# EAGLE design CR78-TB (EAGLE 7.6.0)
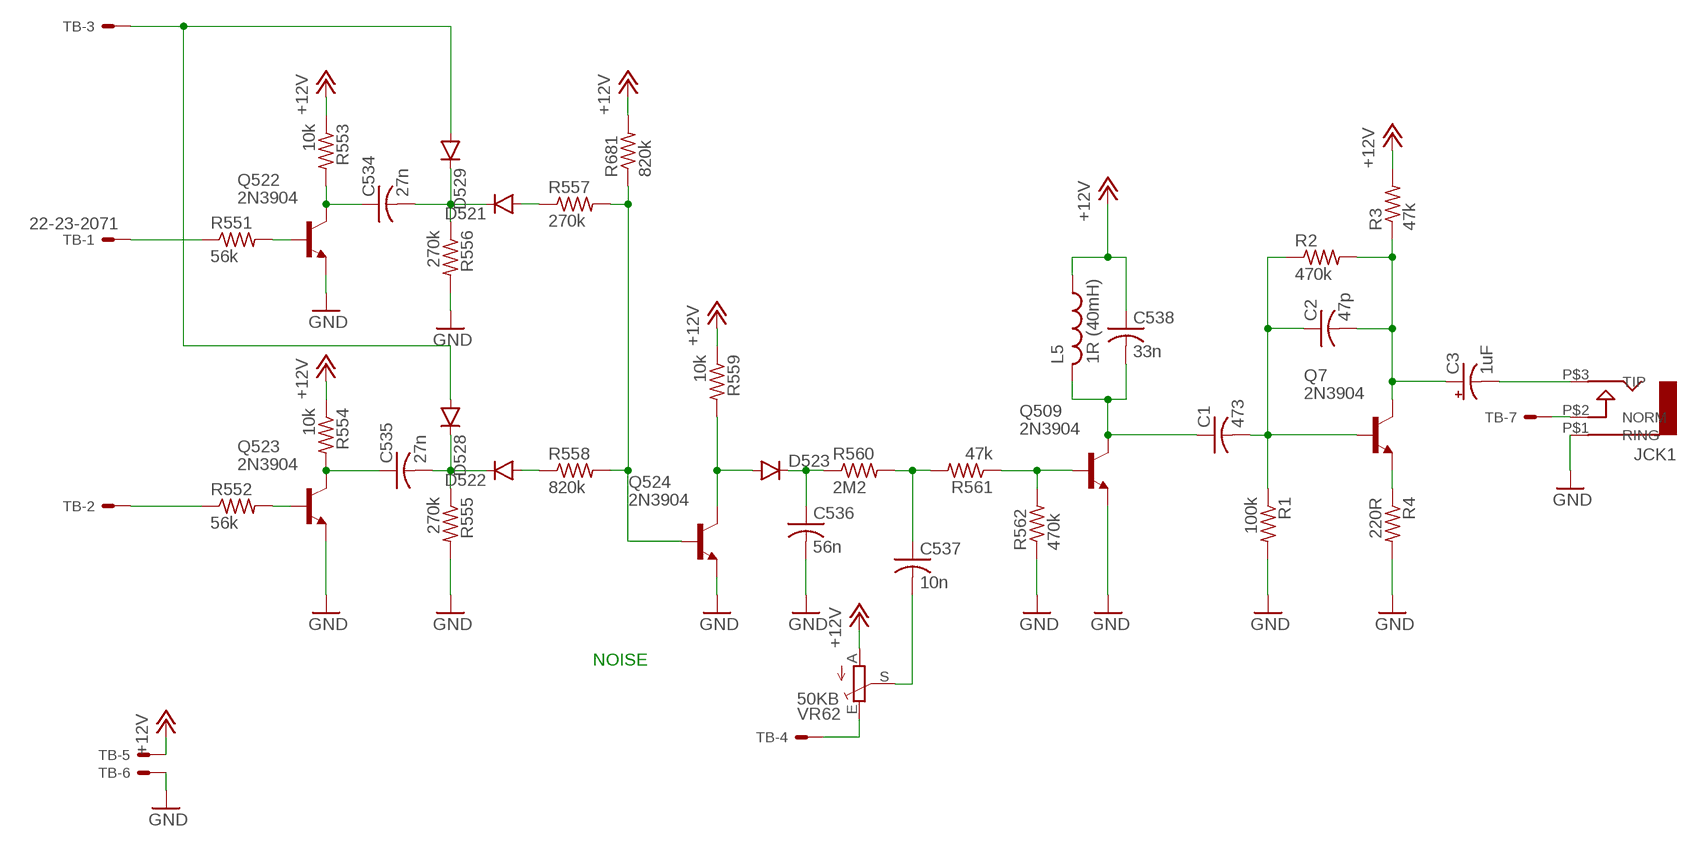
[diagram p0: schematic, sheet 1]

## Parts
C1  473  C-US050-025X075  [C050-025X075]
C2  47p  C-US050-025X075  [C050-025X075]
C3  1uF  CPOL-USB45181A  [B45181A]
C534  27n  C-US050-025X075  [C050-025X075]
C535  27n  C-US050-025X075  [C050-025X075]
C536  56n  C-US050-025X075  [C050-025X075]
C537  10n  C-US050-025X075  [C050-025X075]
C538  33n  C-US050-025X075  [C050-025X075]
D521  DIODE1N4148  [DIODE-1N4148]
D522  DIODE1N4148  [DIODE-1N4148]
D523  DIODE1N4148  [DIODE-1N4148]
D528  DIODE1N4148  [DIODE-1N4148]
D529  DIODE1N4148  [DIODE-1N4148]
JCK1  AUDIO-JACK  [ERTHENVAR-JACK-90DEG]
L5  1R (40mH)  L-US0207/5V  [0207/5V]
Q7  2N3904  [TO92]
Q509  2N3904  [TO92]
Q522  2N3904  [TO92]
Q523  2N3904  [TO92]
Q524  2N3904  [TO92]
R1  100k  R-US_0207/7  [0207/7]
R2  470k  R-US_0207/7  [0207/7]
R3  47k  R-US_0207/7  [0207/7]
R4  220R  R-US_0207/7  [0207/7]
R551  56k  R-US_0207/5V  [0207/5V]
R552  56k  R-US_0207/5V  [0207/5V]
R553  10k  R-US_0207/7  [0207/7]
R554  10k  R-US_0207/10  [0207/10]
R555  270k  R-US_0207/7  [0207/7]
R556  270k  R-US_0207/7  [0207/7]
R557  270k  R-US_0207/7  [0207/7]
R558  820k  R-US_0207/7  [0207/7]
R559  10k  R-US_0207/7  [0207/7]
R560  2M2  R-US_0207/7  [0207/7]
R561  47k  R-US_0207/7  [0207/7]
R562  470k  R-US_0207/7  [0207/7]
R681  820k  R-US_0207/7  [0207/7]
TB  22-23-2071  [22-23-2071]
VR62  50KB  TRIM_EU-B64Y  [B64Y]

## Nets
+12V: C538.1 L5.1 R3.2 R553.1 R554.1 R559.1 R681.2 TB.5 VR62.A
GND: C536.2 JCK1.P$1(RING) Q509.3(E) Q522.3(E) Q523.3(E) Q524.3(E) R1.2 R4.2 R555.2 R556.2 R562.1 TB.6
N$1: C535.2 D522.C D528.C R555.1
N$2: D522.A R558.1
N$3: TB.4 VR62.E
N$4: C536.1 D523.C R560.1
N$5: C537.1 R560.2 R561.2
N$6: C1.1 C538.2 L5.2 Q509.1(C)
N$7: JCK1.P$2(NORM) TB.7
N$9: D523.A Q524.1(C) R559.2
N$10: Q509.2(B) R561.1 R562.2
N$11: R552.1 TB.2
N$14: Q524.2(B) R557.2 R558.2 R681.1
N$15: Q7.3(E) R4.1
N$16: C2.2 C3.+ Q7.1(C) R2.2 R3.1
N$17: C537.2 VR62.S
N$18: C1.2 C2.1 Q7.2(B) R1.1 R2.1
N$19: C3.- JCK1.P$3(TIP)
N$20: C534.1 Q522.1(C) R553.2
N$21: Q522.2(B) R551.2
N$22: C534.2 D521.C D529.C R556.1
N$23: D521.A R557.1
N$24: R551.1 TB.1
N$25: D528.A D529.A TB.3
N$46: C535.1 Q523.1(C) R554.2
N$47: Q523.2(B) R552.2

## Notes on the sheet
- NOISE

## Library data of the parts
C1 C2 C534-C538 = rcl:C-US: CAPACITOR, American symbol
C3 = rcl:CPOL-US: POLARIZED CAPACITOR, American symbol
D521-D523 D528 D529 = SparkFun-DiscreteSemi:DIODE: Diode These are standard reverse protection diodes and small signal diodes. SMA package can handle up to about 1A. SOD-323 can handle about 200mA. What the SOD-323 package when ordering, there are some mfgs out there that are 5-pin packages.
JCK1 = erthenvar:AUDIO-JACK: Switching Mono 3.5mm Audio Jack from Erthenvar.
L5 = rcl:L-US: INDUCTOR, American symbol
Q7 Q509 Q522-Q524 = 808_lt:2N3904: NPN Transistor
R1-R4 R551-R562 R681 = rcl:R-US_: RESISTOR, American symbol
TB = con-molex:22-23-2071: .100" (2.54mm) Center Header - 7 Pin; MF: MOLEX; MPN: 22-23-2071; OC_FARNELL: 1654534; OC_NEWARK: 56H0445
VR62 = TR808clone:TRIM_EU-: POTENTIOMETER

## Net classes
0 default: width 0.635 mm, drill 0.254 mm, clearance 0.254 mm
1 GND: width 1.016 mm, drill 1.016 mm, clearance 0.508 mm

## Board
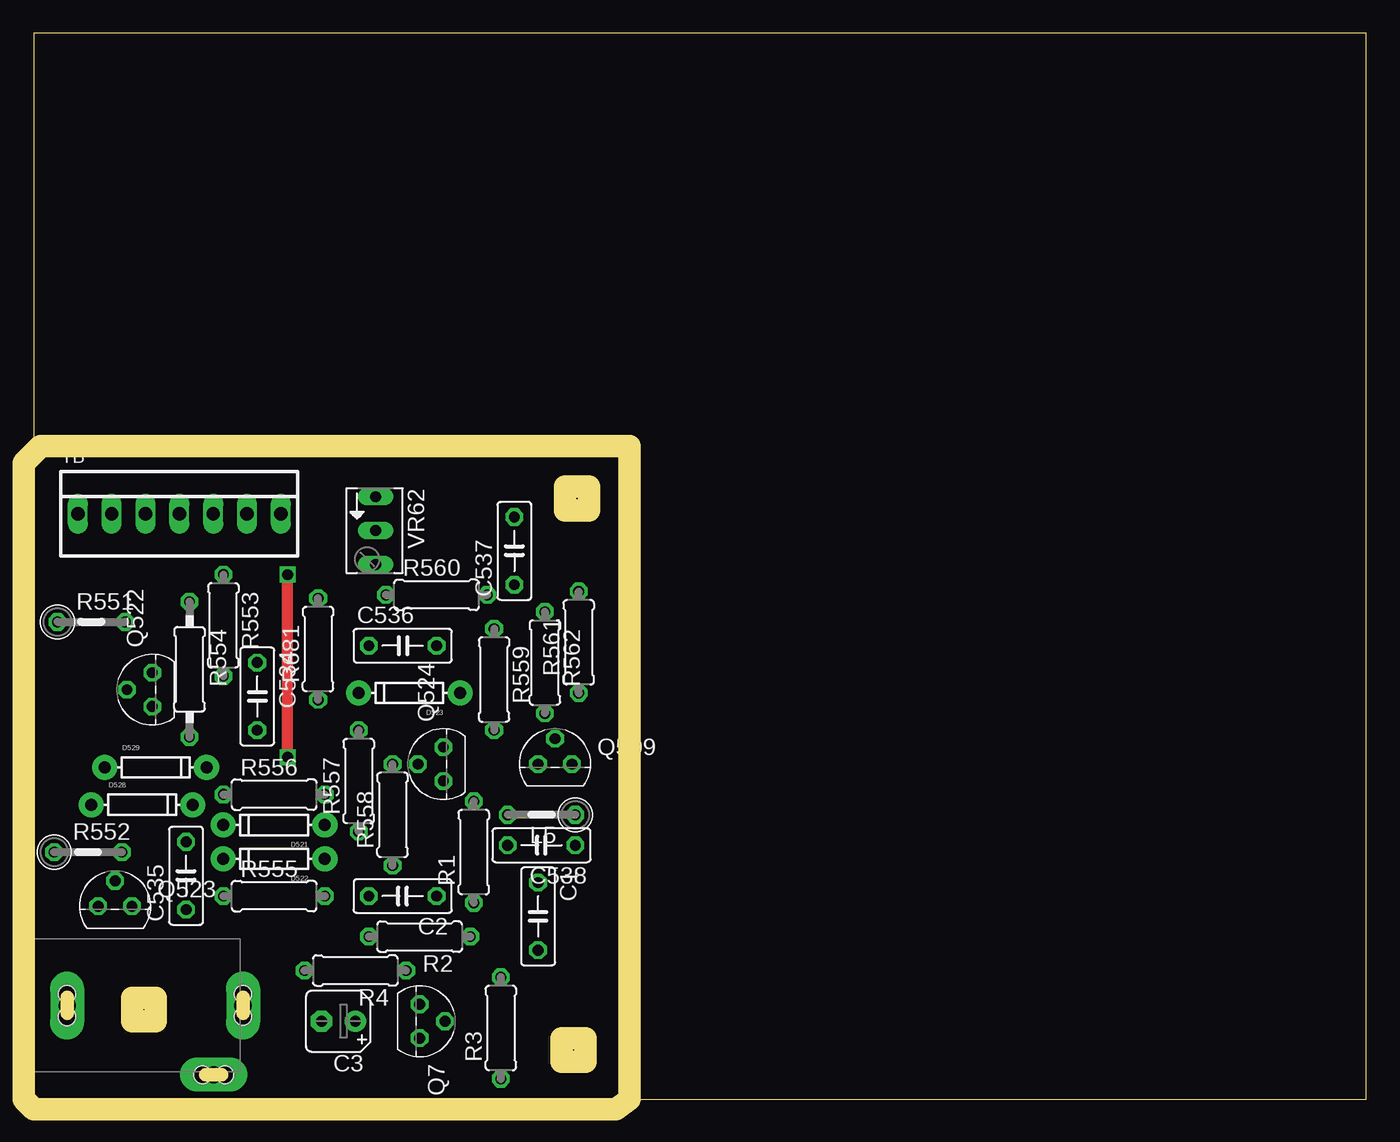
[diagram p1: board, top side]
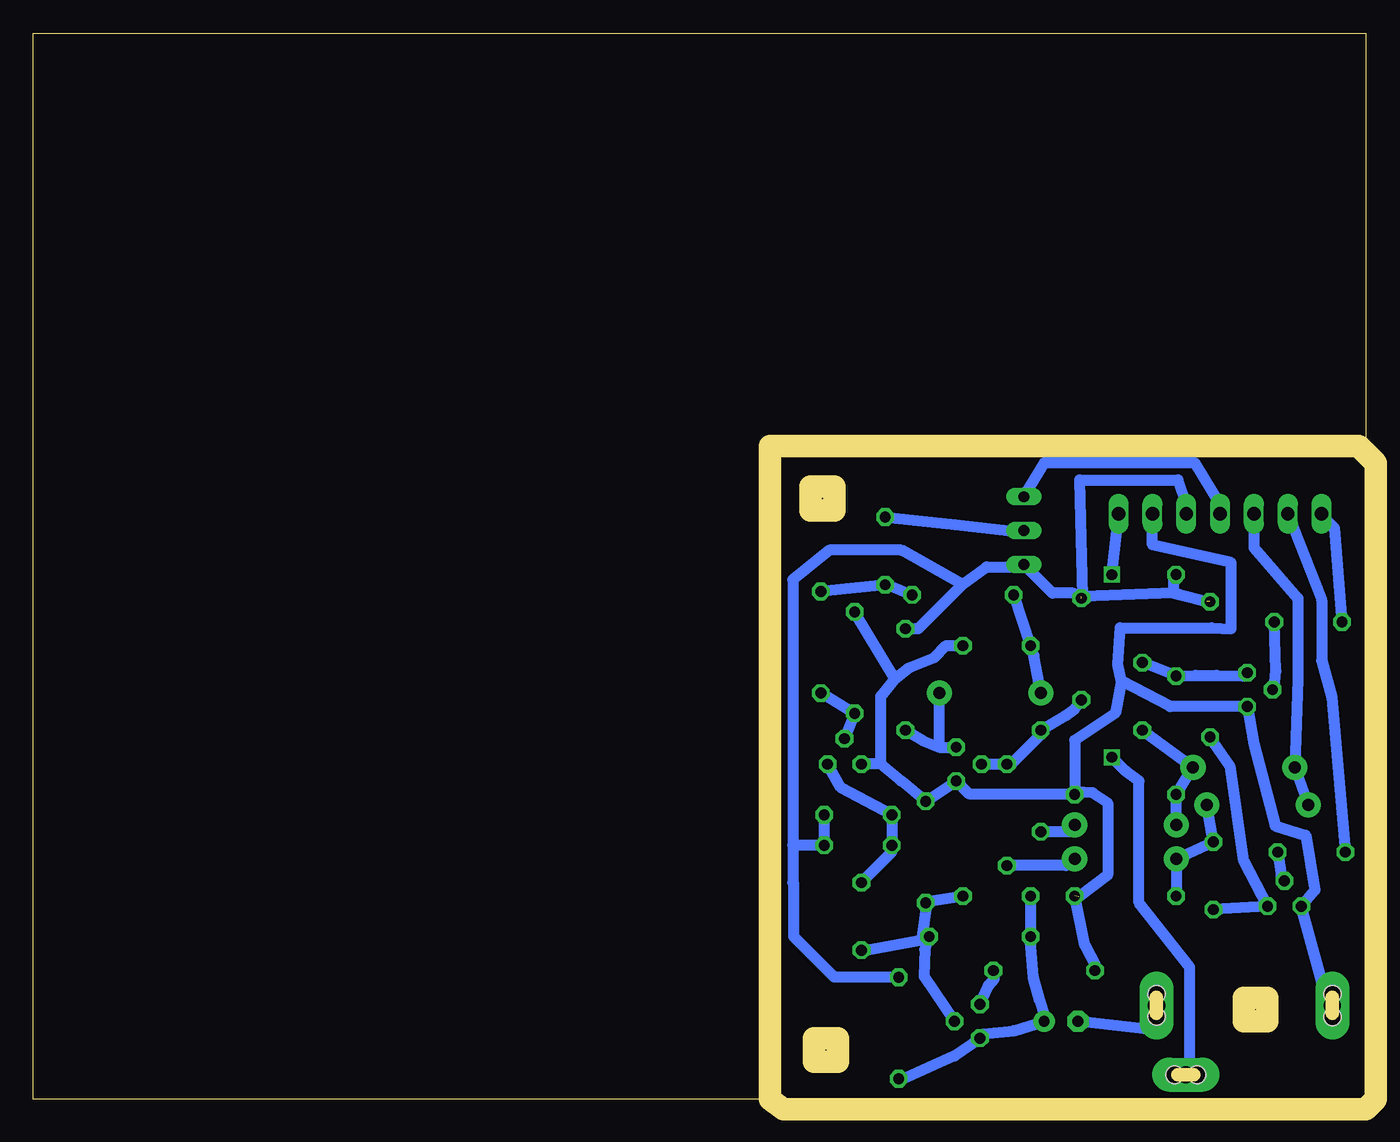
[diagram p2: board, bottom side, seen from below]

Size 100 x 80 mm. Coordinates in mm from the lower left corner, seen from the top.
Outline: 0,0 100,0 100,80 0,80 0,0
Copper layers (1*16): Top 0.035mm / dielectric 1.5mm / Bottom 0.035mm
Design rules "default *": minimum track width 32mil, minimum drill 31mil, track to track 18mil, track to pad 18mil, pad to pad 18mil, via to via 18mil, smd to smd 8mil, copper to edge 0mil, drill to drill 18mil, minimum pad ring 10mil, minimum via ring 8mil, stop-mask expansion 4mil, vias tented up to drill 0mil, thermal gap 10mil
Milling: 19 lines

### Footprints (pad centres in the part's own frame; a part is rotated, then mirrored left to right if it is on the bottom)
C050-025X075 = drill 0.813 octagon: 1 -2.54,0; 2 2.54,0
B45181A = drill 0.813 pad 1.6: + -1.27,0 | drill 0.813 pad 1.6 octagon: - 1.27,0
DIODE-1N4148 = drill 0.9 pad 1.88: A -3.81,0; C 3.81,0
ERTHENVAR-JACK-90DEG = drill 1.3 pad 2.54 long: P$1 5,-2.5; P$2 -0.2,-13.5; P$3 5,-15.7 | hole 1.3: 5.842,-2.489; 4.14,-2.489; -0.203,-12.649; -0.203,-14.351; 5.842,-15.697; 4.166,-15.697
0207/5V = drill 0.813 octagon: 1 -2.54,0; 2 2.54,0
TO92 = drill 0.813 octagon: 1 1.27,0; 2 0,1.905; 3 -1.27,0
0207/7 = drill 0.813 octagon: 1 -3.81,0; 2 3.81,0
0207/10 = drill 0.813 octagon: 1 -5.08,0; 2 5.08,0
22-23-2071 = drill 1 long: 1 -7.62,0; 2 -5.08,0; 3 -2.54,0; 4 0,0; 5 2.54,0; 6 5.08,0; 7 7.62,0
B64Y = drill 0.813 long: A 2.54,0; E -2.54,0; S 0,0

### Placement (x,y rotation side)
C1  37.85,13.72 270 top
C2  27.69,15.24 180 top
C3  22.86,5.84 180 top
C534  16.76,30.23 270 top
C535  11.43,16.76 90 top
C536  27.69,34.04 0 top
C537  36.07,41.15 90 top
C538  38.1,19.05 180 top
D521  18.03,20.57 180 top
D522  18.03,18.03 180 top
D523  28.19,30.48 180 top
D528  8.13,22.1 0 top
D529  9.14,24.89 0 top
JCK1  0,2.03 90 top
L5  38.1,21.34 180 top
Q7  28.96,5.84 270 top
Q509  39.12,25.15 0 top
Q522  8.89,30.73 90 top
Q523  6.1,14.48 0 top
Q524  30.73,25.15 90 top
R1  33.02,18.54 90 top
R2  28.96,12.19 180 top
R3  35.05,5.33 90 top
R4  24.13,9.65 180 top
R551  4.32,35.81 0 top
R552  4.06,18.54 0 top
R553  14.22,35.56 270 top
R554  11.68,32.26 270 top
R555  18.03,15.24 0 top
R556  18.03,22.86 0 top
R557  24.38,23.88 90 top
R558  26.92,21.34 90 top
R559  34.54,31.5 270 top
R560  30.23,37.85 0 top
R561  40.89,34.29 90 top
R562  38.35,32.77 270 top
R681  21.34,33.78 90 top
TB  10.92,43.94 0 top
VR62  25.65,42.67 270 top

### Tracks (layer width: path | path; a pad name or v marks a point on that pad's centre or on a via)
+12V  (2 unrouted)
  Bottom 0.813: 11.94,37.34 14,37.88 14.41,37.97 | 14.41,37.97 21.21,37.72 | 21.21,37.72 21.34,37.72 21.97,37.97 23.5,37.97 VR62.A 25.84,39.94 28.45,39.94 30.26,38.64 | TB.5 13.46,44.58 14.1,46.48 21.46,46.48 21.21,37.72 | 30.26,38.64 33.59,35.31 R559.1 | 42.99,19.05 42.99,38.99 40.26,41.21 34.86,41.21 30.26,38.64 | 42.99,19.05 42.99,16.26 42.93,16.19 42.93,12.19 39.88,9.14 R3.2 | 14.41,37.97 14.41,39.18 R553.1 | L5.1 C538.1 42.99,19.05
GND  (1 unrouted)
  Bottom 0.813: TB.6 16,41.59 10.1,40.26 10.1,35.31 11.56,35.37 18.41,35.37 18.61,32.64 18.35,31.37 | 18.35,31.37 14.67,29.46 Q522.3 8.38,26.67 6.79,20.51 4.51,19.81 3.81,15.68 Q523.3 2.79,7.07 JCK1.P$1 | 18.35,31.37 18.8,28.96 21.84,26.92 R556.2 21.84,22.92 22.23,22.92 | 36.39,25.15 34.86,23.88 R1.2 Q524.3 29.78,22.92 22.23,22.92 | 35.34,31.53 36.39,30.23 36.39,25.15 | 35.34,31.53 34.23,32.38 32.38,33.15 31.5,34.04 C536.2 | R4.2 20.26,9.84 20.26,9.97 21.08,11.56 R555.2 | 21.53,15.18 19.37,16.83 19.37,22.23 20.51,22.99 21.72,23.05 22.23,22.92 | R562.1 35.34,31.53 | 36.39,25.15 Q509.3
N$1
  Bottom 0.813: 14.16,15.24 R555.1 D522.C C535.2 D528.C
N$2
  Bottom 0.813: R558.1 22.48,17.53 21.84,18.16 D522.A
N$3
  Bottom 0.813: TB.4 10.92,44.58 12.83,47.75 24.13,47.75 VR62.E
N$4
  Bottom 0.813: R560.1 C536.1 24.89,33.27 D523.C
N$5
  Bottom 0.813: R560.2 35.81,38.61 C537.1 R561.2
N$6
  Bottom 0.813: C1.1 35.56,18.54 C538.2 L5.2 39.37,23.37 Q509.1
N$7  (via drill 0.8)
  Top 0.813: v19.05,25.65 v19.05,39.37
  Bottom 0.813: JCK1.P$2 13.21,3.05 13.21,9.91 17.02,14.73 17.02,23.88 18.03,24.64 v19.05,25.65 | v19.05,39.37 TB.7
N$9
  Bottom 0.813: 32,26.42 33.27,26.92 R559.2 | 32,26.42 Q524.1 | 32,26.42 D523.A
N$10
  Bottom 0.813: R561.1 R562.2 Q509.2
N$11
  Bottom 0.813: TB.2 3.3,37.47 3.3,32.89 2.54,30.16 R552.1
N$14
  Bottom 0.813: Q524.2 R558.2 26.61,25.15 24.38,27.37 R557.2 22.54,28.77 21.84,29.27 R681.1
N$15
  Bottom 0.813: Q7.3 28.32,8.51 27.88,9.02 R4.1
N$16
  Bottom 0.813: C2.2 R2.2 25.15,11.87 24.96,9.14 24.45,7.37 24.07,6.22 C3.+ 26.42,5.14 28.7,4.89 29.02,4.45 Q7.1 30.86,3.24 34.86,1.46 R3.1
N$17
  Bottom 0.813: C537.2 30.8,43.12 26.16,42.61 VR62.S
N$18
  Bottom 0.813: Q7.2 33.15,9.21 33.08,11.24 R2.1 32.83,12.45 33.31,11.91 | C1.2 37.4,11.18 33.31,11.91 | 33.31,11.91 32.89,14.86 | 32.89,14.86 C2.1 | 32.89,14.86 R1.1
N$19
  Bottom 0.813: JCK1.P$3 16.34,5.25 C3.-
N$20
  Bottom 0.813: Q522.1 9.21,31.75 11.18,31.81 12.76,31.81 R553.2 C534.1
N$21
  Bottom 0.813: Q522.2 6.86,30.86 6.73,32.13 R551.2
N$22
  Bottom 0.813: D521.C R556.1 D529.C C534.2
N$23
  Bottom 0.813: R557.1 22.16,20.07 21.84,20.38 D521.A
N$24
  Bottom 0.813: TB.1 3.11,43.62 2.35,42.86 R551.1
N$25
  Bottom 0.813: TB.3 8.38,41.4 5.08,37.59 5.08,31.5 D529.A D528.A
N$46
  Bottom 0.813: C535.1 Q523.1 9.14,17.84 10.16,24.96 R554.2
N$47
  Bottom 0.813: Q523.2 6.35,16.76 R552.2